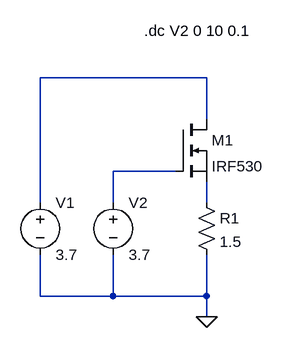
[diagram p0: schematic Draft3.asc]
Draft3.asc, the LTspice schematic file:
Version 4
SHEET 1 880 680
WIRE 240 64 -16 64
WIRE 240 128 240 64
WIRE 192 208 96 208
WIRE -16 256 -16 64
WIRE 96 256 96 208
WIRE 240 256 240 224
WIRE -16 400 -16 336
WIRE 96 400 96 336
WIRE 96 400 -16 400
WIRE 240 400 240 336
WIRE 240 400 96 400
WIRE 240 432 240 400
FLAG 240 432 0
SYMBOL nmos 192 128 R0
SYMATTR InstName M1
SYMATTR Value IRF530
SYMBOL res 224 240 R0
SYMATTR InstName R1
SYMATTR Value 1.5
SYMBOL voltage -16 240 R0
WINDOW 123 0 0 Left 0
WINDOW 39 0 0 Left 0
SYMATTR InstName V1
SYMATTR Value 3.7
SYMBOL voltage 96 240 R0
WINDOW 123 0 0 Left 0
WINDOW 39 0 0 Left 0
SYMATTR InstName V2
SYMATTR Value 3.7
TEXT 144 -8 Left 2 !.dc V2 0 10 0.1

The netlist it stands for:
* Draft3.asc
M1 N001 N002 N003 N003 IRF530
R1 N003 0 1.5
V1 N001 0 3.7
V2 N002 0 3.7
.model NMOS NMOS
.model PMOS PMOS
.lib standard.mos
.dc V2 0 10 0.1
.backanno
.end